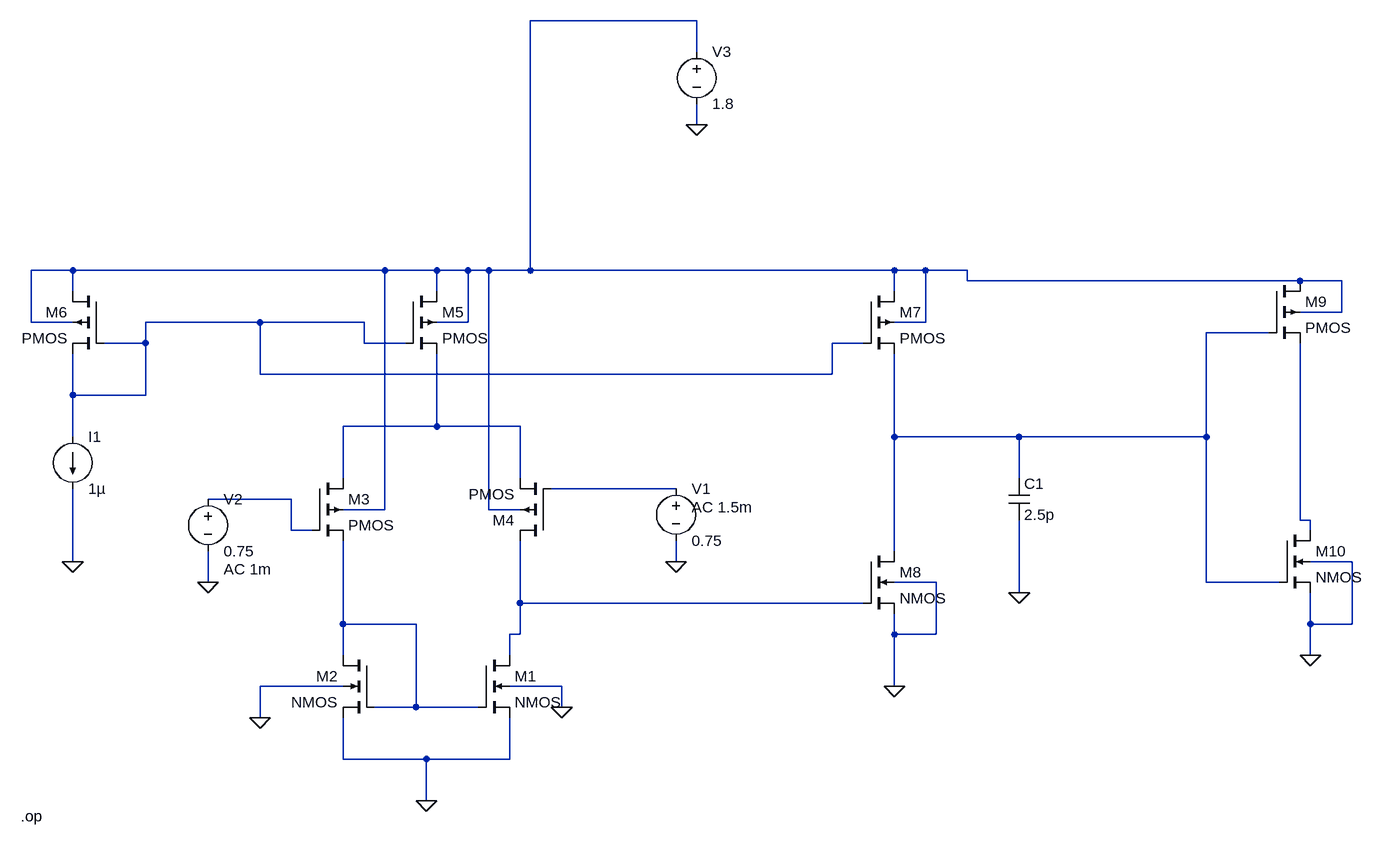
[diagram p0: schematic pmos_input_comparator.asc]
pmos_input_comparator.asc, the LTspice schematic file:
Version 4
SHEET 1 1636 680
WIRE 608 -784 352 -784
WIRE 608 -736 608 -784
WIRE 608 -624 608 -656
WIRE -352 -400 -416 -400
WIRE 128 -400 -352 -400
WIRE 208 -400 128 -400
WIRE 256 -400 208 -400
WIRE 288 -400 256 -400
WIRE 352 -400 352 -784
WIRE 352 -400 288 -400
WIRE 720 -400 352 -400
WIRE 912 -400 720 -400
WIRE 960 -400 912 -400
WIRE 1024 -400 960 -400
WIRE 1024 -384 1024 -400
WIRE 1072 -384 1024 -384
WIRE 1536 -384 1072 -384
WIRE 1600 -384 1536 -384
WIRE -352 -368 -352 -400
WIRE 208 -368 208 -400
WIRE 912 -368 912 -400
WIRE 1600 -336 1600 -384
WIRE 1600 -336 1536 -336
WIRE -416 -320 -416 -400
WIRE -352 -320 -416 -320
WIRE -64 -320 -240 -320
WIRE 64 -320 -64 -320
WIRE 96 -320 64 -320
WIRE 256 -320 256 -400
WIRE 256 -320 208 -320
WIRE 960 -320 960 -400
WIRE 960 -320 912 -320
WIRE 1488 -304 1392 -304
WIRE -240 -288 -240 -320
WIRE -240 -288 -304 -288
WIRE 96 -288 96 -320
WIRE 160 -288 96 -288
WIRE 864 -288 816 -288
WIRE -64 -240 -64 -320
WIRE 448 -240 -64 -240
WIRE 816 -240 816 -288
WIRE 816 -240 448 -240
WIRE -352 -208 -352 -272
WIRE -240 -208 -240 -288
WIRE -240 -208 -352 -208
WIRE 208 -160 208 -272
WIRE 208 -160 64 -160
WIRE 336 -160 208 -160
WIRE -352 -144 -352 -208
WIRE 912 -144 912 -272
WIRE 960 -144 912 -144
WIRE 1104 -144 960 -144
WIRE 1312 -144 1104 -144
WIRE 1392 -144 1392 -304
WIRE 1392 -144 1312 -144
WIRE 1536 -144 1536 -288
WIRE 64 -80 64 -160
WIRE 336 -80 336 -160
WIRE 1104 -80 1104 -144
WIRE 576 -64 384 -64
WIRE -16 -48 -144 -48
WIRE 912 -48 912 -144
WIRE 128 -32 128 -400
WIRE 128 -32 64 -32
WIRE 288 -32 288 -400
WIRE 336 -32 288 -32
WIRE 1536 -16 1536 -144
WIRE 1552 -16 1536 -16
WIRE -16 0 -16 -48
WIRE 16 0 -16 0
WIRE 1552 0 1552 -16
WIRE 912 32 912 -48
WIRE -352 48 -352 -64
WIRE 336 48 336 16
WIRE 576 48 576 16
WIRE 1616 48 1552 48
WIRE 64 64 64 16
WIRE -144 80 -144 32
WIRE 976 80 912 80
WIRE 1392 80 1392 -144
WIRE 1504 80 1392 80
WIRE 1104 96 1104 -16
WIRE 336 112 336 48
WIRE 432 112 336 112
WIRE 864 112 432 112
WIRE 64 144 64 64
WIRE 176 144 64 144
WIRE 1552 144 1552 96
WIRE 1616 144 1616 48
WIRE 1616 144 1552 144
WIRE 336 160 336 112
WIRE 336 160 320 160
WIRE 912 160 912 128
WIRE 976 160 976 80
WIRE 976 160 912 160
WIRE 64 192 64 144
WIRE 320 192 320 160
WIRE 1552 192 1552 144
WIRE 64 240 -64 240
WIRE 400 240 320 240
WIRE 912 240 912 160
WIRE 176 272 176 144
WIRE 176 272 112 272
WIRE 272 272 176 272
WIRE 400 272 400 240
WIRE -64 288 -64 240
WIRE 64 352 64 288
WIRE 192 352 64 352
WIRE 320 352 320 288
WIRE 320 352 192 352
WIRE 192 416 192 352
FLAG 400 272 0
FLAG -64 288 0
FLAG 912 240 0
FLAG -352 48 0
FLAG 192 416 0
FLAG 1104 96 0
FLAG 576 48 0
FLAG -144 80 0
FLAG 1552 192 0
FLAG 608 -624 0
DATAFLAG 1072 -384 ""
DATAFLAG 720 -400 ""
DATAFLAG 64 -320 ""
DATAFLAG 448 -240 ""
DATAFLAG 1312 -144 ""
DATAFLAG 1536 -144 ""
DATAFLAG 960 -144 ""
DATAFLAG 912 -48 ""
DATAFLAG 432 112 ""
DATAFLAG 64 64 ""
DATAFLAG 336 48 ""
SYMBOL nmos4 272 192 R0
SYMATTR InstName M1
SYMATTR Value2 l=5u w=20u
SYMBOL nmos4 112 192 M0
SYMATTR InstName M2
SYMATTR Value2 l=5u w=20u
SYMBOL pmos4 16 -80 R0
SYMATTR InstName M3
SYMATTR Value2 l=1u w=20u
SYMBOL pmos4 384 16 R180
SYMATTR InstName M4
SYMATTR Value2 l=1u w=20u
SYMBOL pmos4 160 -368 R0
SYMATTR InstName M5
SYMATTR Value2 l=2u w=20u
SYMBOL current -352 -144 R0
WINDOW 123 0 0 Left 2
WINDOW 39 0 0 Left 2
SYMATTR InstName I1
SYMATTR Value 1µ
SYMBOL pmos4 864 -368 R0
SYMATTR InstName M7
SYMATTR Value2 l=2u w=20u
SYMBOL nmos4 864 32 R0
SYMATTR InstName M8
SYMATTR Value2 l=1u w=20u
SYMBOL pmos4 -304 -368 M0
SYMATTR InstName M6
SYMATTR Value2 l=2u w=20u
SYMBOL cap 1088 -80 R0
SYMATTR InstName C1
SYMATTR Value 2.5p
SYMBOL voltage 576 -80 R0
WINDOW 123 24 44 Left 2
WINDOW 39 0 0 Left 2
SYMATTR InstName V1
SYMATTR Value 0.75
SYMATTR Value2 AC 1.5m
SYMBOL voltage -144 -64 R0
WINDOW 123 24 124 Left 2
WINDOW 39 0 0 Left 2
SYMATTR InstName V2
SYMATTR Value 0.75
SYMATTR Value2 AC 1m
SYMBOL pmos4 1488 -384 R0
SYMATTR InstName M9
SYMATTR Value2 l=1u w=20u
SYMBOL nmos4 1504 0 R0
SYMATTR InstName M10
SYMBOL voltage 608 -752 R0
WINDOW 123 0 0 Left 2
WINDOW 39 0 0 Left 2
SYMATTR InstName V3
SYMATTR Value 1.8
TEXT -432 440 Left 2 !.op

The netlist it stands for:
* pmos_input_comparator.asc
M1 N008 N009 0 0 NMOS l=5u w=20u
M2 N009 N009 0 0 NMOS l=5u w=20u
M3 N004 N007 N009 N001 PMOS l=1u w=20u
M4 N008 N006 N004 N001 PMOS l=1u w=20u
M5 N001 N002 N004 N001 PMOS l=2u w=20u
I1 N002 0 1µ
M7 N001 N002 N003 N001 PMOS l=2u w=20u
M8 N003 N008 0 0 NMOS l=1u w=20u
M6 N001 N002 N002 N001 PMOS l=2u w=20u
C1 N003 0 2.5p
V1 N006 0 0.75 AC 1.5m
V2 N007 0 0.75 AC 1m
M9 N001 N003 N005 N001 PMOS l=1u w=20u
M10 N005 N003 0 0 NMOS
V3 N001 0 1.8
.model NMOS NMOS
.model PMOS PMOS
.lib standard.mos
.op
.backanno
.end